# EasyEDA Pro project modular_design.eprj, board PCB1
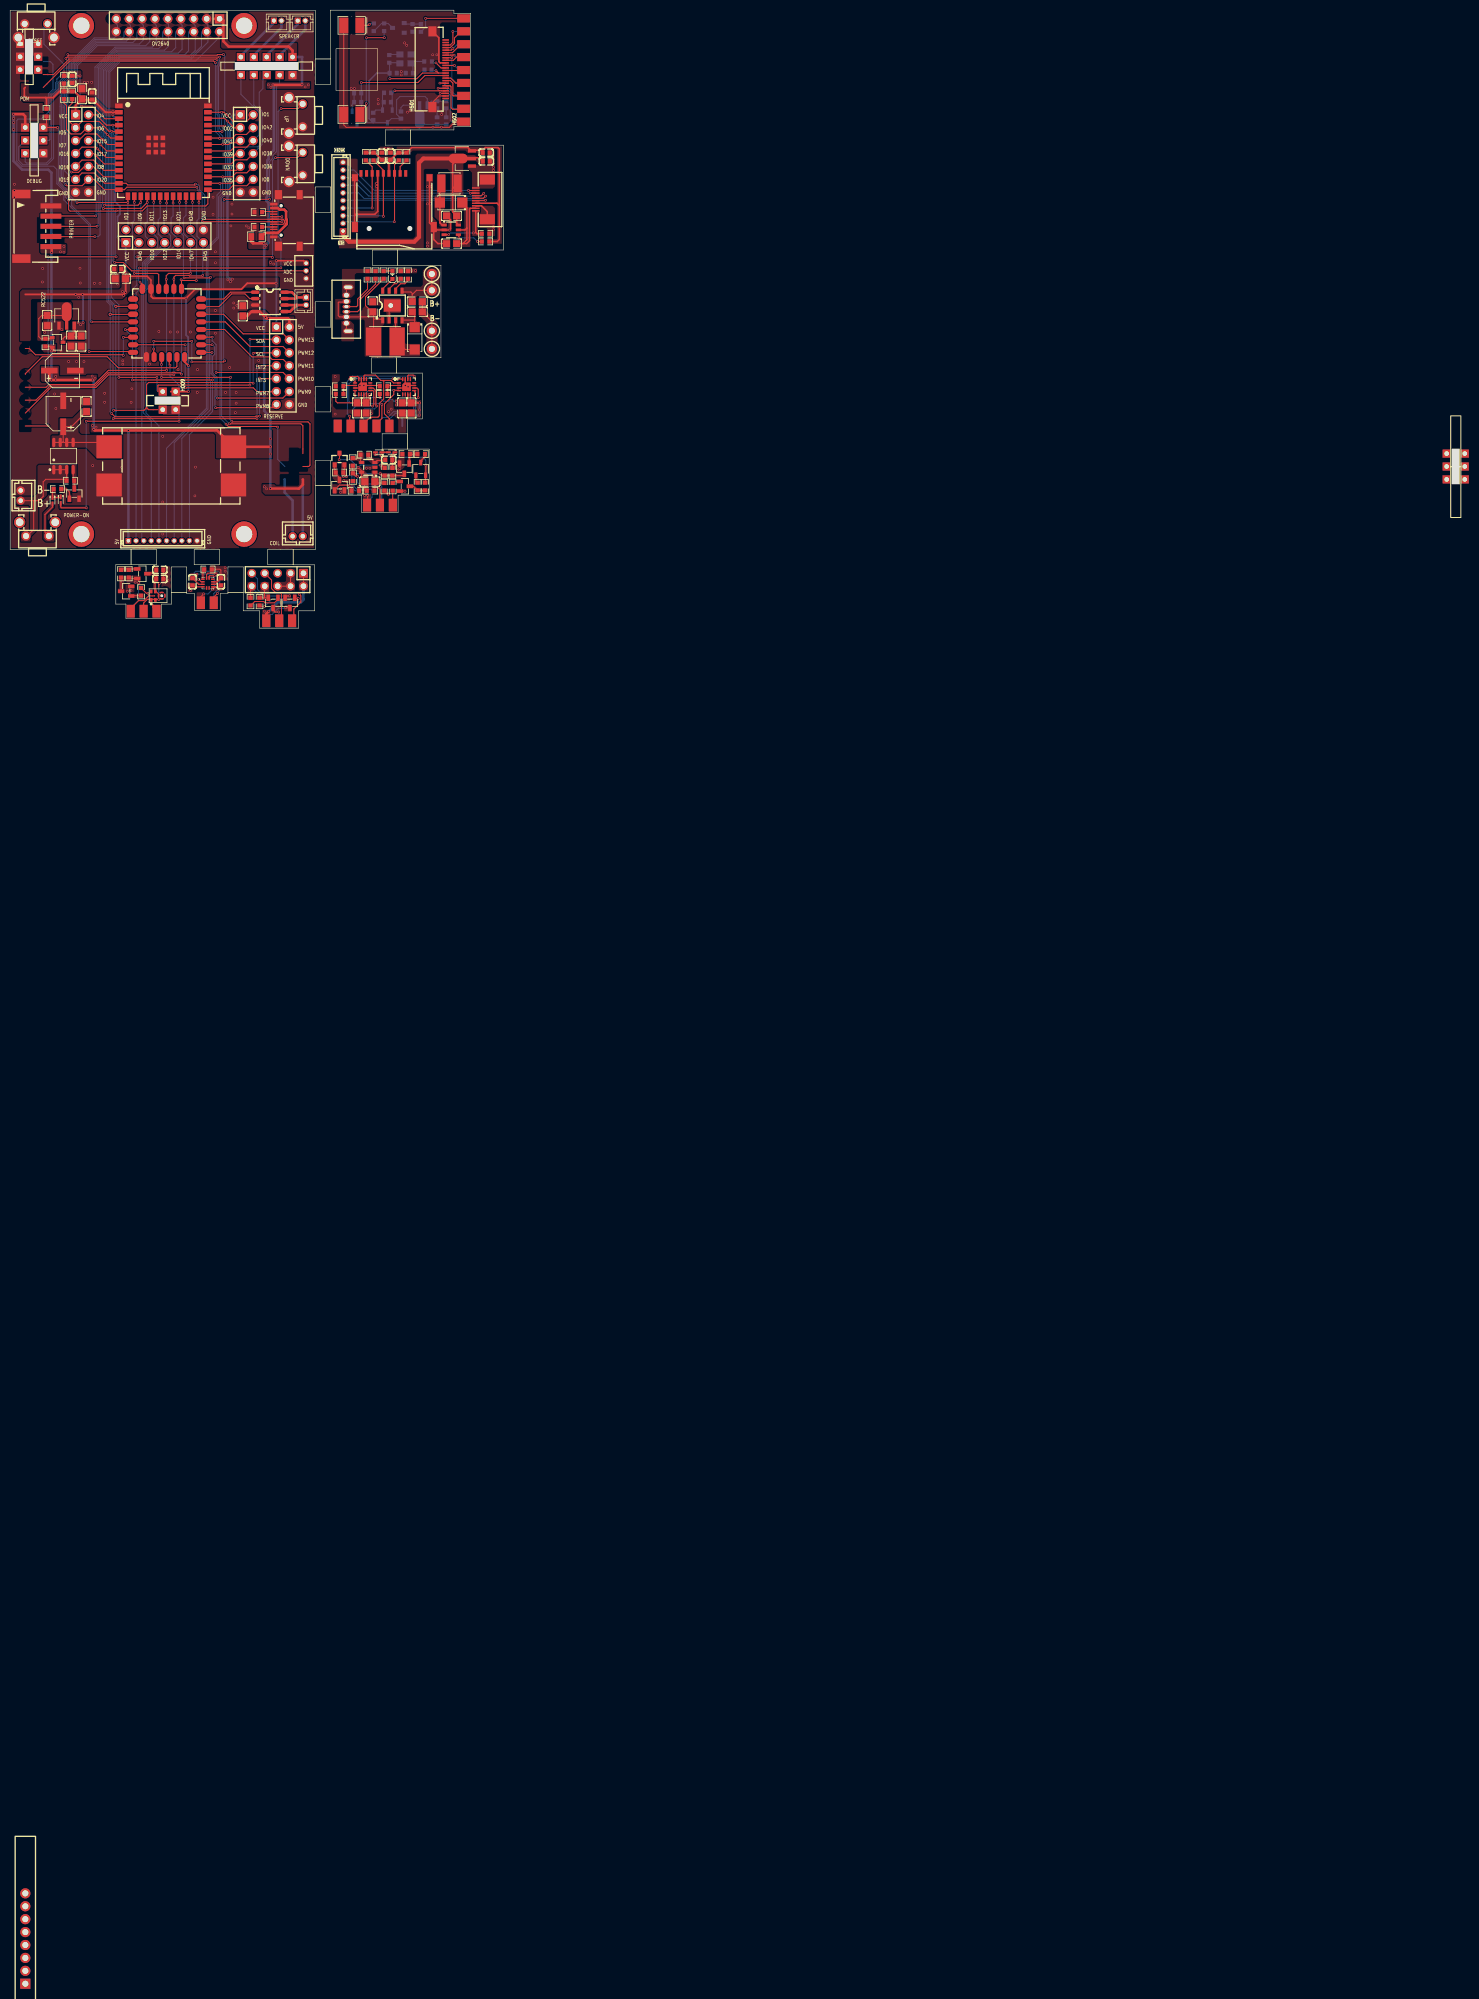
[diagram p7: board, top side]
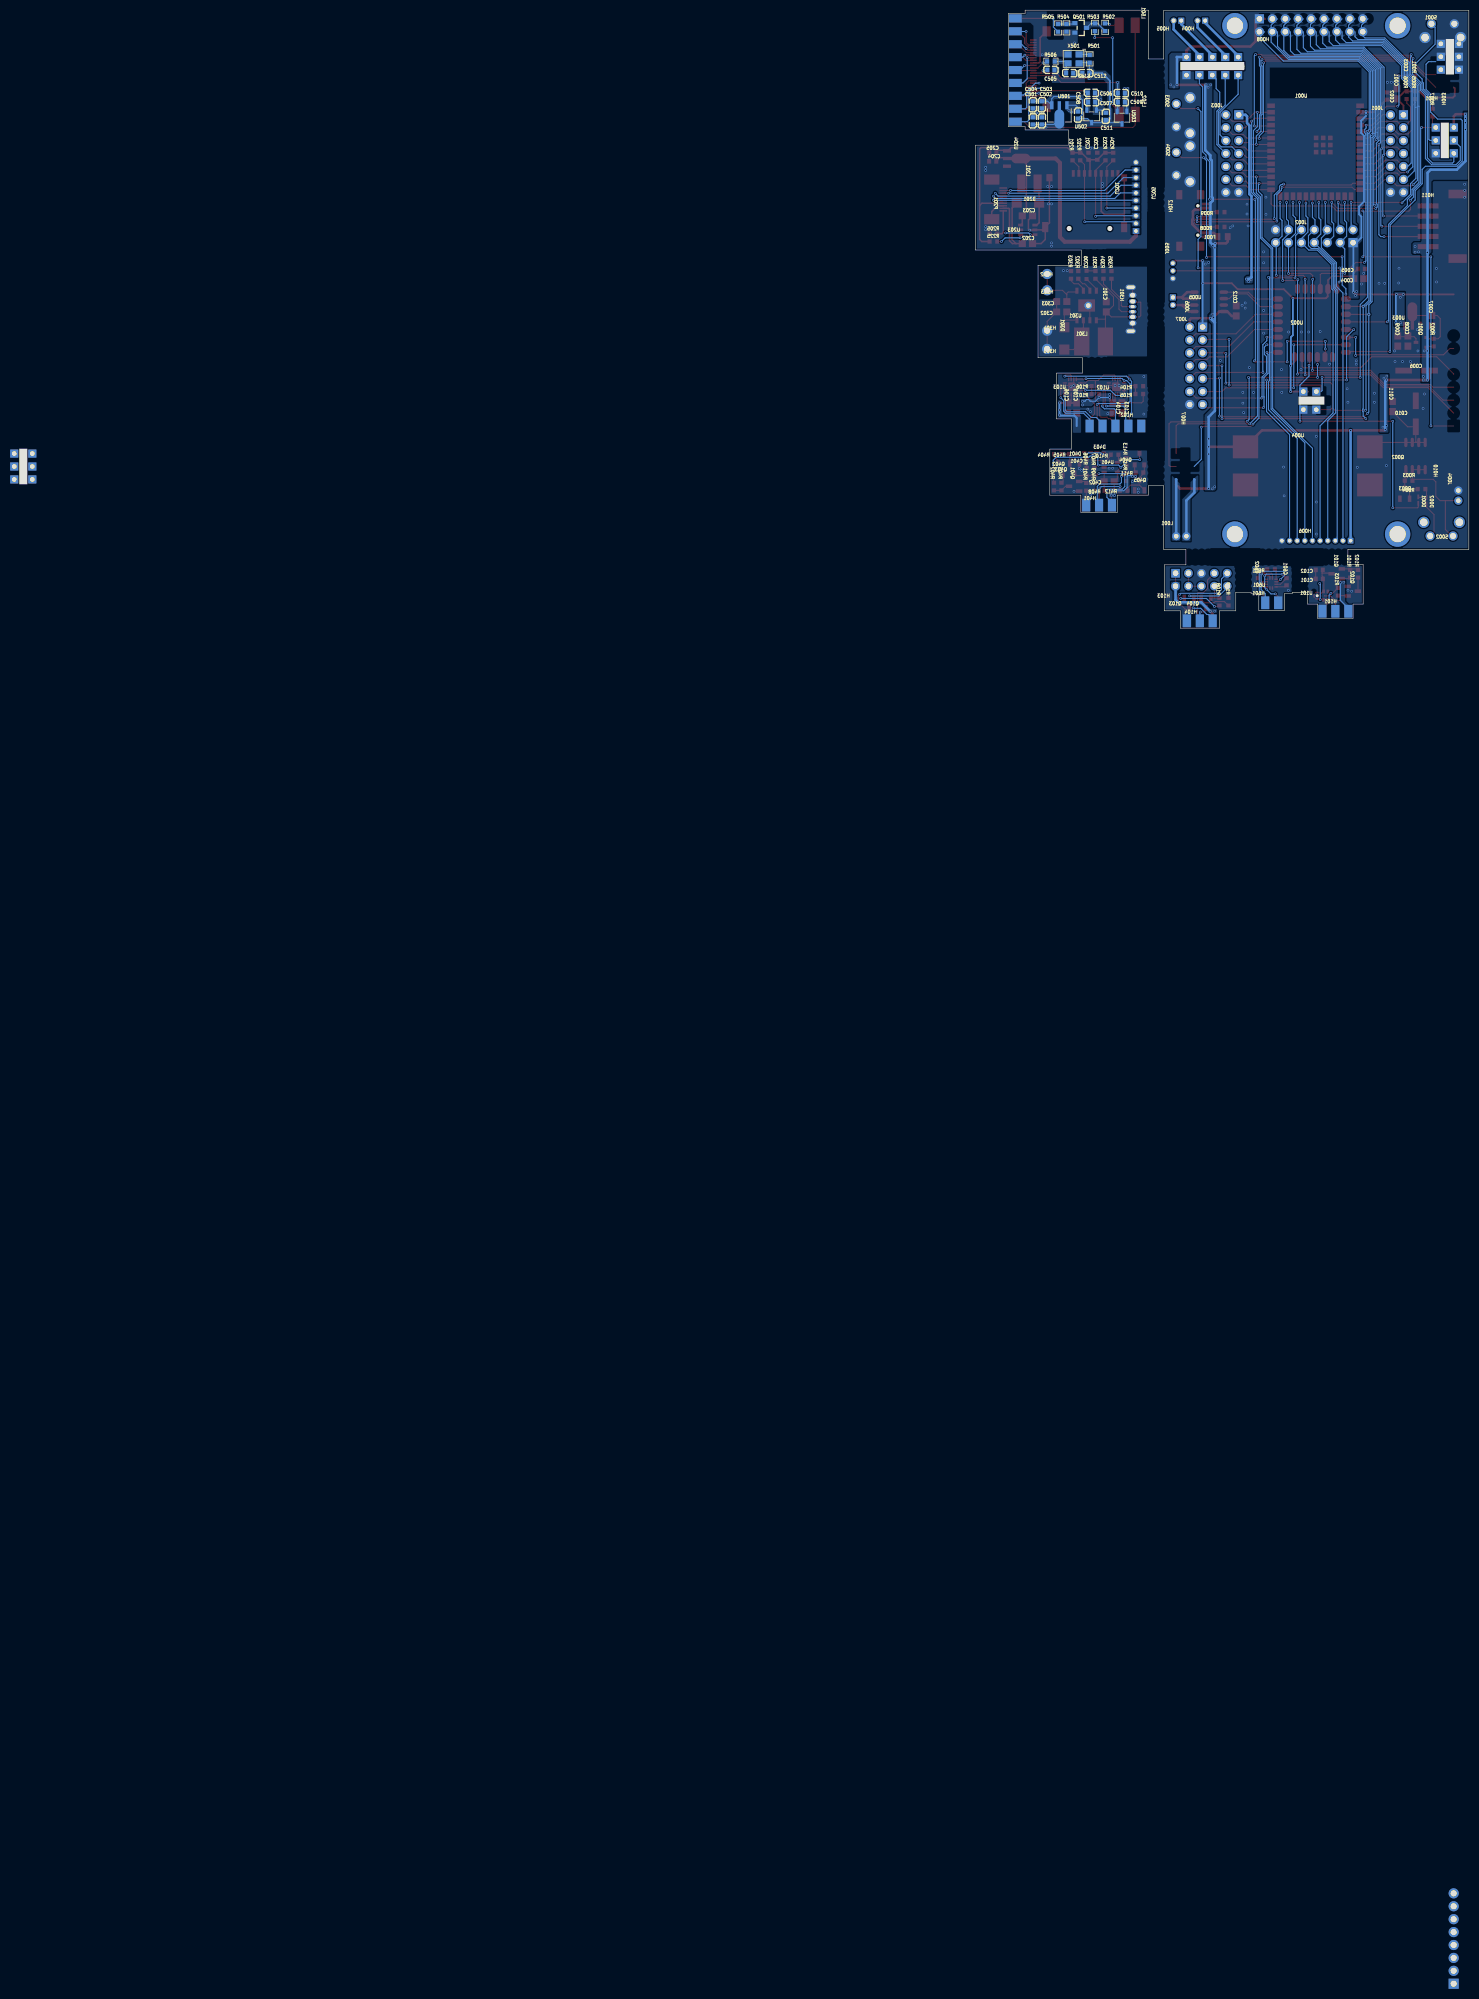
[diagram p8: board, bottom side, seen from below]

Outline 285.05 x 121.54 mm; copper layers: Top Layer, Bottom Layer. Coordinates in mm from the lower left corner of the outline.
Outline path: 0,121.49 60,121.49 60,111.94 62.99,111.94 62.99,121.52 63.01,121.54 87.25,121.54 87.25,120.91 90.56,120.91 90.56,98.63 87.25,98.63 87.25,97.99 78.76,97.99 78.76,94.99 96.99,94.99 96.99,74.37 76.22,74.37 76.22,71.37 84.71,71.37 84.71,53.18 76,53.18 76,50.16 81.05,50.16 81.05,41.15 78.12,41.15 78.12,35.22 82.39,35.22 82.39,26.15 76.29,26.15 76.29,22.75 69.14,22.75 69.14,26.16 63.03,26.16 63.03,28 60.02,28 60.02,15.47 55.64,15.47 55.64,12.45 59.89,12.45 59.89,3.42 59.87,3.4 56.73,3.4 56.73,0 49.04,0 49.04,3.4 45.83,3.4 45.83,7.04 42.83,7.04 42.83,6.84 41.3,6.84 41.3,3.5 36.23,3.5 36.23,6.84 34.71,6.84 34.71,7.04 31.7,7.04 31.7,4.73 29.73,4.73 29.73,1.93 22.76,1.93 22.76,4.73 20.78,4.73 20.78,12.49 23.78,12.49 23.78,15.49 0,15.49 0,121.49
Stack: Top Layer 0.035mm / Dielectric1 1.51mm FR4 er 4.5 / Bottom Layer 0.035mm

## Design rules (mm)
template: 自定义配置
spacing copperThickness1oz (default): track to track 0.102, other pairs 0.05 to 0.3
track width copperThickness1oz (default): min 0.127, default 0.254, max 2.54
track width copperThickness2oz: min 0.203, default 0.254, max 2.54
differential pair differentialPair (default): width min 0.127, default 0.254, max 2.54; gap min 0.152, default 0.152
via viaSize (default): diameter min 0.5, default 0.5, max 10; hole min 0.3, default 0.3, max 6.3

## Placement (name value [footprint] x y rotation side)
C001  10uF  [C0805]  14.12 105.1 90 top
C002  100nF  [C0603]  16.11 104.65 90 top
C003  100nF  [C0603]  12.22 107.93 90 top
C004  10uF  [C0805]  21.66 68.73 0 top
C005  100nF  [C0603]  21.15 70.64 0 top
C006  100uF  [CAP-SMD_BD6.3-L6.6-W6.6-LS7.2-R-RD]  10.26 50.64 180 top
C007  100nF  [C0805]  7.27 60.49 90 top
C008  10uF  [C0805]  11.99 56.46 90 top
C009  100nF  [C0805]  13.98 56.46 90 top
C010  100uF  [CAP-SMD_BD6.3-L6.6-W6.6-LS7.2-R-RD]  10.43 42.16 270 top
C011  100nF  [C0805]  15.02 43.58 270 top
C012  10uF  [C0805]  45.75 62.4 90 top
C101  100nF  [C0603]  29.42 9.68 180 top
C102  100nF  [C0603]  29.42 11.46 180 top
C103  100nF  [C0805]  68.22 43.31 90 top
C104  100nF  [C0805]  70 43.31 90 top
C105  100nF  [C0805]  77.11 43.31 90 top
C106  100nF  [C0805]  78.89 43.31 90 top
C201  100nF  [C0603]  74.79 92.81 270 top
C202  100nF  [C0805]  86.8 75.64 0 top
C203  100nF  [C0805]  86.8 81.09 0 top
C204  100nF  [C0603]  93.63 91.81 180 top
C205  100nF  [C0603]  93.61 93.52 180 top
C206  100nF  [C0603]  73.07 92.81 270 top
C301  10uF  [C0805]  71.29 63.19 90 top
C302  22uF  [C0805]  80.05 62.19 0 top
C303  100uF  [C0805]  80.05 64.23 0 top
C401  1uF  [C0603]  74.45 33.1 0 top
C402  1uF  [C0805]  70.73 28.82 180 top
C501  100nF  [C0603]  85.73 99.77 270 bottom
C502  10uF  [C0603]  83.95 99.77 270 bottom
C503  10uF  [C0603]  83.95 102.94 90 bottom
C504  100nF  [C0603]  85.73 102.94 90 bottom
C505  0.1UF  [C0603]  82.17 109.8 0 bottom
C506  10UF  [C0603]  74.21 105.29 180 bottom
C507  0.1UF  [C0603]  74.17 103.45 180 bottom
C508  0.1UF  [C0603]  76.84 100.91 270 bottom
C509  10UF  [C0603]  68.33 103.45 180 bottom
C510  0.1UF  [C0603]  68.33 105.23 180 bottom
C511  0.1UF  [C0603]  71.38 100.66 270 bottom
C512  100nF  [C0603]  75.32 109.17 0 bottom
C513  20pF  [C0603]  78.49 109.17 0 bottom
C601  104  [C0603]  35.85 9.12 270 top
C602  104  [C0603]  41.44 9.12 270 top
D001  1N4148WT  [SOD-523_L1.2-W0.8-LS1.6-RD]  9.93 25.19 270 top
D002  1N4148WT  [SOD-523_L1.2-W0.8-LS1.6-RD]  8.32 25.06 270 top
D201  SS14  [SMA_L4.3-W2.6-LS5.2-RD]  86.7 83.69 180 top
D206  LED_0603-R  [LED_0603]  75.16 69.52 90 top
D301  SS34A  [SMA_L4.3-W2.6-LS5.2-RD]  79.55 56.99 270 top
D401  1N4148WT  [SOD-523_L1.2-W0.8-LS1.6-RD]  75.01 34.58 180 top
D403  1N4148WT  [SOD-523_L1.2-W0.8-LS1.6-RD]  72.46 34.58 180 top
F001  10K  [R0805]  48.41 77 0 top
H001  PZ254V-12-6P  [PDM_MODULE]  4.73 108.88 180 top
H002  -  [I2S_HT517_STEREO]  50.45 110.53 90 top
H003  PZ254V-12-6P  [CH343_DEBUG]  4.73 95.92 0 top
H004  B2B-ZR(LF)(SN)  [CONN-TH_B2B-ZR-LF-SN]  52.6 119.48 180 top
H005  B2B-ZR(LF)(SN)  [CONN-TH_B2B-ZR-LF-SN]  57.3 119.48 180 top
H006  -  [connector_p10_1.5mm]  30 17.18 0 top
H007  -  [Metal_Detect]  55.78 31.79 180 top
H008  -  [connector_p2*9_2.54]  30 118.57 180 top
H009  A2541HWV-2x2P  [SC7A20_MODULE]  30 44.74 270 top
H010  -  [RFID_RC522]  4.98 29.76 90 top
H011  HX20007-5AWB  [CONN-SMD_5P-P2.00_HX20007-5AWB]  5.11 79.03 270 top
H012  TYPEC-304S-ACP16  [USB-C-SMD_TYPEC-304S-ACP16]  54.38 80.18 90 top
H101  PZ254V-12-6P  [Finger_2*3]  23.7 3.33 0 top
H102  -  [Finger_2*5]  66.95 39.76 0 top
H103  MTP125-1205S1  [HDR-TH_10P-P2.54-V-M-R2-C5-S2.54]  52.59 9.53 180 top
H104  PZ254V-12-6P  [Finger_2*3]  50.36 1.45 0 top
H301  -  [typec-31-e-11]  66.09 62.73 90 top
H302  -  [Single_Pin]  82.92 69.66 0 top
H303  -  [Single_Pin]  82.92 66.44 0 top
H304  -  [Single_Pin]  82.92 58.49 0 top
H305  -  [Single_Pin]  82.92 54.92 0 top
H401  PZ254V-12-6P  [Finger_2*3]  70.17 24.19 0 top
H501  AFC01-S24FCA-00  [FPC-SMD_P0.50-24P_FGS-XJ-H2.0]  84.33 109.93 90 top
H502  -  [Finger_2*9]  89.16 104.69 90 top
H601  A2541HWV-2x2P  [Finger_2*2]  37.5 4.98 0 top
J001  2.54-2*7P母  [HDR-TH_14P-P2.54-V-F-R2-C7-S2.54-1]  14.13 93.34 270 top
J002  2.54-2*7P母  [HDR-TH_14P-P2.54-V-F-R2-C7-S2.54-1]  30.39 77.08 0 top
J003  2.54-2*7P母  [HDR-TH_14P-P2.54-V-F-R2-C7-S2.54-1]  46.51 93.34 270 top
J004  B2B-ZR(LF)(SN)  [connector_p2_2.0mm]  2.06 26.07 270 top
J005  -  [conn-dip-1*3-1.5mm]  58.19 70.27 270 top
J006  B2B-ZR(LF)(SN)  [CONN-TH_B2B-ZR-LF-SN]  58.19 64.3 90 top
J007  2.54-2*7P母  [HDR-TH_14P-P2.54-V-F-R2-C7-S2.54-1]  53.62 51.6 270 top
L001  470uH  [connector_p2_2.0mm]  56.54 18.07 0 top
L201  22uH  [IND-SMD_L4.0-W4.0]  86.39 87.47 180 top
L301  4.7uH  [IND-SMD_L5.8-W5.2]  73.79 56.38 0 top
L501  暖白3528LED灯珠  [LED-SMD_L3.6-W2.9-R-RD]  67.19 118.56 180 top
L502  暖白3528LED灯珠  [LED-SMD_L3.6-W2.9-R-RD]  67.19 101.04 180 top
NOREF  -  [Pad_e163]  14 18.49 0 top
NOREF#2  -  [Pad_e160]  14 118.49 0 top
NOREF#3  -  [Pad_e2609]  74.83 63.45 90 top
NOREF#4  -  [Pad_e164]  46 18.49 90 top
NOREF#5  -  [Pad_e162]  46 118.49 180 top
P201  0.5-10P上接  [FPC_0.5_10P_mirror]  93.81 84.3 90 top
Q001  SS8550  [SOT-23-3_L2.9-W1.4-P1.90-LS2.6-BR]  9.34 56.21 180 top
Q002  AO4407C  [SOP-8_L4.9-W3.9-P1.27-LS6.0-BL]  10.48 33.84 0 top
Q003  SS8050  [SOT-23-3_L2.9-W1.3-P1.90-LS2.4-BR]  12.6 26.46 270 top
Q101  AO3407  [SOT-23-3_L2.9-W1.3-P1.90-LS2.4-BR]  25.99 10.7 180 top
Q102  SS8050  [SOT-23-3_L2.9-W1.3-P1.90-LS2.4-BR]  22.81 7.27 0 top
Q103  SS8050  [SOT-23-3_L2.9-W1.3-P1.90-LS2.4-BR]  55.01 4.95 90 top
Q104  SS8050  [SOT-23-3_L2.9-W1.3-P1.90-LS2.4-BR]  51.7 4.95 90 top
Q401  MMBT3904  [SOT-23-3_L2.9-W1.3-P1.90-LS2.4-BR]  77.61 27.9 180 top
Q402  MMBT3906-7-F  [SOT-23-3_L2.9-W1.6-P1.90-LS2.8-BR]  80.72 31.32 270 top
Q403  AO3402A  [SOT-23-3_L2.9-W1.3-P1.90-LS2.4-BR]  77.51 31.37 90 top
Q404  AO3401A  [SOT-23_L2.9-W1.3-P1.90-LS2.4-BR]  64.76 33.25 270 top
Q405  MMBT3904  [SOT-23-3_L2.9-W1.3-P1.90-LS2.4-BR]  64.76 28.1 270 top
Q501  AO3404A  [SOT-23_L2.9-W1.3-P1.90-LS2.4-BR]  76.33 118.06 0 bottom
R001  10K  [R0603]  10.57 107.86 270 top
R002  10K  [R0603]  6.94 56.16 90 top
R003  10K  [R0603]  11.84 29 180 top
R004  10K  [R0603]  9.3 27.34 180 top
R005  10K  [R0603]  10.57 104.81 90 top
R006  10K  [R0603]  12.22 104.81 90 top
R007  10K  [R0603]  7.14 101.39 90 top
R008  10K  [R0603]  48.8 78.91 0 top
R009  10K  [R0603]  48.8 81.83 0 top
R101  10K  [R0603]  23.32 10.7 270 top
R102  10R  [R0603]  21.8 10.7 90 top
R103  1K  [R0603]  25.73 7.14 90 top
R104  NC  [R0603]  64.79 47.58 180 top
R105  NC  [R0603]  64.79 46.05 180 top
R106  NC  [R0603]  73.42 47.58 180 top
R107  NC  [R0603]  73.42 46.05 180 top
R108  NC  [R0603]  49.04 5.21 270 top
R109  NC  [R0603]  47.26 5.21 270 top
R201  10K  [R0603]  77.93 92.76 270 top
R202  10K  [R0603]  76.41 92.76 90 top
R203  10K  [R0603]  71.45 92.76 90 top
R204  10K  [R0603]  69.93 92.76 90 top
R205  10K  [R0603]  93.48 77.57 180 top
R225  10K  [R0603]  93.48 76.04 180 top
R301  1K  [R0603]  73.43 69.47 270 top
R302  10K  [R0603]  76.8 69.47 270 top
R303  10K  [R0603]  78.22 69.47 270 top
R304  10K  [R0603]  71.85 69.47 270 top
R305  10K  [R0603]  70.27 69.47 270 top
R401  10K  [R0603]  75.22 27.8 90 top
R402  10K  [R0603]  81.59 27.85 90 top
R403  10K  [R0603]  80.11 27.85 90 top
R404  10K  [R0603]  80.83 34.22 0 top
R405  10K  [R0603]  77.87 34.22 0 top
R406  10K  [R0603]  73.64 30.76 90 top
R407  10K  [R0603]  75.17 30.76 270 top
R408  10K  [R0603]  70.88 27.03 0 top
R409  10K  [R0603]  73.58 27.8 270 top
R410  10K  [R0603]  69.66 34.12 0 top
R411  10K  [R0603]  64.76 30.6 180 top
R412  10K  [R0603]  67.87 27.03 180 top
R413  10K  [R0603]  67.36 32.69 90 top
R414  10K  [R0603]  67.41 29.68 90 top
R501  1K  [R0603]  74.55 111.96 270 bottom
R502  1K  [R0603]  71.51 118.18 90 bottom
R503  1K  [R0603]  73.54 118.18 270 bottom
R504  1K  [R0603]  79.13 118.06 90 bottom
R505  1K  [R0603]  80.78 118.06 270 bottom
R506  1K  [R0603]  82.17 111.45 180 bottom
R601  10K  [R0603]  38.9 11.53 180 top
S001  TC-1102N-C-A-B  [SW-TH_TC-1102N-C-A-B]  5.11 117.51 180 top
S002  TC-1102N-C-A-B  [SW-TH_TC-1102N-C-A-B]  5.36 19.47 0 top
S003  TC-1102N-C-A-B  [SW-TH_TC-1102N-C-A-B]  56.17 100.84 90 top
S004  TC-1102N-C-A-B  [SW-TH_TC-1102N-C-A-B]  56.17 91.32 90 top
U001  -  [ESP32-S3-WROOM-1U]  30.26 93.85 0 top
U002  -  [GPBA02B-C]  32.03 59.73 0 top
U003  ME6206A33PG  [SOT-89-3_L4.5-W2.5-P1.50-LS4.2-BR]  11.1 60.85 270 top
U004  -  [CX8823_MO]  18.19 39.41 0 top
U005  -  [sop-8_l5.0-w4.0-p1.27-ls6.2-bl]  51.08 64.17 270 top
U101  -  [SD18OB261-104]  28.4 6.38 0 top
U102  HT517  [QFN-16_L3.0-W3.0-P0.50-TL-EP1.7]  69.31 47.48 0 top
U103  HT517  [QFN-16_L3.0-W3.0-P0.50-TL-EP1.7]  77.94 47.48 0 top
U201  -  [TF-01A]  75.54 82.27 0 top
U203  MT9201  [SOT-23-6_L2.9-W1.6-P0.95-LS2.8-BR]  86.74 78.33 180 top
U204  ME6206A33PG  [SOT-89-3_L4.5-W2.5-P1.50-LS4.2-BR]  89.45 92.36 0 top
U205  -  [connector_p10_1.5mm]  65.46 84.86 90 top
U301  CS5095E  [ESOP-8_L4.9-W3.9-P1.27-LS6.0-BL-EP]  75.16 63.45 0 top
U401  LM321-TR  [SOT-23-5_L3.0-W1.7-P0.95-LS2.8-BR]  70.42 31.62 0 top
U501  ME6206A33PG  [SOT-89-3_L4.5-W2.5-P1.50-LS4.2-BR]  80.52 101.49 90 bottom
U502  XC6206-2.8V  [SOT-23-3_L2.9-W1.6-P1.90-LS2.8-BR]  74.17 100.66 90 bottom
U503  XC6206-1.2V  [SOT-23-3_L2.9-W1.6-P1.90-LS2.8-BR]  68.2 100.4 90 bottom
U601  -  [LGA-12_L2.0-W2.0-P0.50-TL]  38.9 8.87 0 top
X501  24MHz  [OSC-SMD_4P-L3.2-W2.5-BL]  77.73 111.96 0 bottom

## Footprints (pads in the part's own frame, mm; a bottom-side part is the same pattern mirrored in y, then rotated)
C0603
  rect 0.8x0.9 smd: 1(-0.7,0) 2(0.7,0)
C0805
  rect 1.41x1.35 smd: 1(-1,0) 2(1,0)
CAP-SMD_BD6.3-L6.6-W6.6-LS7.2-R-RD
  rect 3.26x1.15 smd: 1(2.555,0) 2(-2.555,0)
CH343_DEBUG
  rect 1.6x1.6 hole 0.914: 1(-1.778,2.54) 2(1.778,2.54) 3(-1.778,0) 4(1.778,0) 5(-1.778,-2.54) 6(1.778,-2.54)
conn-dip-1*3-1.5mm
  round 1.1 hole 0.701: 1(-1.498,0) 2(0,0) 3(1.498,0)
CONN-SMD_5P-P2.00_HX20007-5AWB
  rect 1.001x4.099 smd: 1(-4,2.901) 2(-1.999,2.901) 3(0,2.901) 4(1.999,2.901) 5(4,2.901)
  rect 1.7x3.599 smd: 6(6.35,-2.901) 7(-6.35,-2.901)
CONN-TH_B2B-ZR-LF-SN
  rect 1.2x1.2 hole 0.8: 1(0.75,0.001)
  round 1.2 hole 0.8: 2(-0.75,-0.001)
connector_p2*9_2.54
  rect 1.801x1.801 hole 1.1: 1(-11.176,-1.27)
  round 1.801 hole 1.1: 2(-11.176,1.27) 3(-8.636,-1.27) 4(-8.636,1.27) 5(-6.096,-1.27) 6(-6.096,1.27) 7(-3.556,-1.27) 8(-3.556,1.27) 9(-1.016,-1.27) 10(-1.016,1.27) 11(1.524,-1.27) 12(1.524,1.27) 13(4.064,-1.27) 14(4.064,1.27) 15(6.604,-1.27) 16(6.604,1.27) 17(9.144,-1.27) 18(9.144,1.27)
connector_p2_2.0mm
  round 1.6 hole 0.899: 1(1.001,0.004) 2(-1.001,0.004)
connector_p10_1.5mm
  rect 1.1x1.1 hole 0.701: 1(-6.749,0.001)
  round 1.1 hole 0.701: 2(-5.25,0.001) 3(-3.749,0.001) 4(-2.251,0.001) 5(-0.75,0.001) 6(0.75,0.001) 7(2.251,0.001) 8(3.749,0.001) 9(5.25,0.001) 10(6.752,0.001)
CX8823_MO
  rect 5x4.5 smd: 1(1.27,-3.75) 2(25.73,-3.75) 3(1.27,-11.25) 4(25.73,-11.25)
ESOP-8_L4.9-W3.9-P1.27-LS6.0-BL-EP
  rect 0.6x1.2 smd: 1(-1.905,-2.909) 2(-0.635,-2.909) 3(0.635,-2.909) 4(1.905,-2.909) 5(1.905,2.909) 6(0.635,2.909) 7(-0.635,2.909) 8(-1.905,2.909)
  rect 3.3x2.4 smd: 9(0,0)
ESP32-S3-WROOM-1U
  rect 1.5x0.9 smd: 1(-8.877,8.895) 2(-8.877,7.625) 3(-8.877,6.355) 4(-8.877,5.085) 5(-8.877,3.815) 6(-8.877,2.545) 7(-8.877,1.275) 8(-8.877,0.005) 9(-8.877,-1.265) 10(-8.877,-2.535) 11(-8.877,-3.805) 12(-8.877,-5.075) 13(-8.877,-6.345) 14(-8.877,-7.615) 27(8.623,-7.615) 28(8.623,-6.345) 29(8.623,-5.075) 30(8.623,-3.805) 31(8.623,-2.535) 32(8.623,-1.265) 33(8.623,0.005) 34(8.623,1.275) 35(8.623,2.545) 36(8.623,3.815) 37(8.623,5.085) 38(8.623,6.355) 39(8.623,7.625) 40(8.623,8.895)
  rect 0.9x1.5 smd: 15(-7.112,-8.895) 16(-5.842,-8.895) 17(-4.572,-8.895) 18(-3.302,-8.895) 19(-2.032,-8.895) 20(-0.762,-8.895) 21(0.508,-8.895) 22(1.778,-8.895) 23(3.048,-8.895) 24(4.318,-8.895) 25(5.588,-8.895) 26(6.858,-8.865)
  rect 0.9x0.9 smd: 41(-3.027,2.575) 41(-3.027,1.175) 41(-3.027,-0.225) 41(-1.627,2.575) 41(-1.627,1.175) 41(-1.627,-0.225) 41(-0.227,2.575) 41(-0.227,1.175) 41(-0.227,-0.225)
Finger_2*2
  rect 1.6x2.5 smd: 1(0,0.006) 3(2.54,0.006)
  rect 1.6x2.5 smd far side: 2(0,0) 4(2.54,0)
Finger_2*3
  rect 1.6x2.5 smd: 1(0,0) 3(2.54,0) 5(5.08,0)
  rect 1.6x2.5 smd far side: 2(0,-0.006) 4(2.54,-0.006) 6(5.08,-0.006)
Finger_2*5
  rect 1.6x2.5 smd: 1(-2.54,0.003) 3(0,0.003) 5(2.54,0.003) 7(5.08,0.003) 9(7.62,0.003)
  rect 1.6x2.5 smd far side: 2(-2.54,-0.003) 4(0,-0.003) 6(2.54,-0.003) 8(5.08,-0.003) 10(7.62,-0.003)
Finger_2*9
  rect 1.6x2.5 smd: 1(-5.08,0.006) 3(-2.54,0.006) 5(0,0.006) 7(2.54,0.006) 9(5.08,0.006) 11(7.62,0) 13(10.16,0) 15(12.7,0) 17(15.24,0)
  rect 1.6x2.5 smd far side: 2(-5.08,0) 4(-2.54,0) 6(0,0) 8(2.54,0) 10(5.08,0) 12(7.62,0) 14(10.16,-0.006) 16(12.7,-0.006) 18(15.24,-0.006)
FPC-SMD_P0.50-24P_FGS-XJ-H2.0
  rect 0.3x1.3 smd: 1(-5.748,-1.3) 2(-5.248,-1.3) 3(-4.748,-1.3) 4(-4.248,-1.3) 5(-3.748,-1.3) 6(-3.248,-1.3) 7(-2.748,-1.3) 8(-2.248,-1.3) 9(-1.748,-1.3) 10(-1.248,-1.3) 11(-0.748,-1.3) 12(-0.248,-1.3) 13(0.252,-1.3) 14(0.752,-1.3) 15(1.252,-1.3) 16(1.752,-1.3) 17(2.252,-1.3) 18(2.752,-1.3) 19(3.252,-1.3) 20(3.752,-1.3) 21(4.252,-1.3) 22(4.752,-1.3) 23(5.252,-1.3) 24(5.752,-1.3)
  rect 2x1.6 smd: 25(7.45,1.3) 26(-7.45,1.3)
FPC_0.5_10P_mirror
  rect 0.299x1.501 smd: 1(-2.235,2.25) 2(-1.738,2.25) 3(-1.237,2.25) 4(-0.737,2.25) 5(-0.236,2.25) 6(0.264,2.25) 7(0.764,2.25) 8(1.265,2.25) 9(1.763,2.25) 10(2.263,2.25)
  rect 1.999x2.999 smd: 11(-3.884,-0.011) 12(3.919,-0.005)
GPBA02B-C
  oval 1.1x2 smd: 2(-6.042,6.993) 35(-4.341,6.983)
  oval 2x1.1 smd: 3(-7.862,5.003) 4(-7.862,3.503) 5(-7.862,2.003) 25(5.519,2.003) 26(5.519,3.503) 27(5.519,5.003)
  oval 2x1 smd: 6(-7.862,0.503) 7(-7.862,-0.997) 8(-7.862,-2.497) 9(-7.862,-3.997) 10(-7.862,-5.497) 20(5.519,-5.497) 21(5.519,-3.997) 22(5.519,-2.497) 23(5.519,-0.997) 24(5.519,0.503)
  oval 1x2 smd: 11(-5.242,-6.417) 12(-3.741,-6.417) 13(-2.241,-6.417) 14(-0.742,-6.417) 15(0.758,-6.417) 17(2.259,-6.417) 30(1.659,7.006) 31(0.159,7.003) 32(-1.341,6.973) 33(-2.821,6.983)
HDR-TH_10P-P2.54-V-M-R2-C5-S2.54
  rect 1.7x1.7 hole 1.1: 1(-5.08,-1.27)
  round 1.7 hole 1.1: 2(-5.08,1.27) 3(-2.54,-1.27) 4(-2.54,1.27) 5(0,-1.27) 6(0,1.27) 7(2.54,-1.27) 8(2.54,1.27) 9(5.08,-1.27) 10(5.08,1.27)
HDR-TH_14P-P2.54-V-F-R2-C7-S2.54-1
  rect 1.801x1.801 hole 1.1: 1(-7.62,-1.27)
  round 1.801 hole 1.1: 2(-7.62,1.27) 3(-5.08,-1.27) 4(-5.08,1.27) 5(-2.54,-1.27) 6(-2.54,1.27) 7(0,-1.27) 8(0,1.27) 9(2.54,-1.27) 10(2.54,1.27) 11(5.08,-1.27) 12(5.08,1.27) 13(7.62,-1.27) 14(7.62,1.27)
I2S_HT517_STEREO
  rect 1.6x1.6 hole 0.914: 1(-1.758,5.08) 2(1.798,5.08) 3(-1.758,2.54) 4(1.798,2.54) 5(-1.758,0) 6(1.798,0) 7(-1.758,-2.54) 8(1.798,-2.54) 9(-1.758,-5.08) 10(1.798,-5.08)
IND-SMD_L4.0-W4.0
  rect 1.6x3.5 smd: 1(-1.6,0) 2(1.6,0)
IND-SMD_L5.8-W5.2
  rect 3x5.5 smd: 1(2.325,0) 2(-2.325,0)
LED-SMD_L3.6-W2.9-R-RD
  rect 1.785x3.024 smd: 1(1.593,0) 2(-1.593,0)
LED_0603
  rect 0.8x0.8 smd: 1(-0.851,-0.01) 2(0.75,-0.005)
LGA-12_L2.0-W2.0-P0.50-TL
  rect 0.7x0.28 smd: 1(-1.002,0.75) 2(-1.002,0.25) 3(-1.002,-0.25) 4(-1.002,-0.75) 7(0.949,-0.75) 8(0.949,-0.25) 9(0.949,0.25) 10(0.949,0.75)
  rect 0.28x0.7 smd: 5(-0.277,-0.975) 6(0.224,-0.975) 11(0.224,0.975) 12(-0.277,0.975)
Metal_Detect
  rect 1.6x1.6 hole 0.914: 1(-230.251,2.54) 2(-226.695,2.54) 3(-230.251,0) 4(-226.695,0) 5(-230.251,-2.54) 6(-226.695,-2.54)
OSC-SMD_4P-L3.2-W2.5-BL
  rect 1.4x1.2 smd: 1(-1.1,-0.875) 2(1.1,-0.875) 3(1.1,0.875) 4(-1.1,0.875)
Pad_e160
  round 5 hole 3.2: (0,0)
Pad_e162
  round 5 hole 3.2: (0,0)
Pad_e163
  round 5 hole 3.2: (0,0)
Pad_e164
  round 5 hole 3.2: (0,0)
Pad_e2609
  round 1.524 hole 0.914: 1(0,0)
PDM_MODULE
  rect 1.6x1.6 hole 0.914: 1(-0.778,-0.96) 2(2.778,-0.96) 3(-0.778,-3.5) 4(2.778,-3.5) 5(-0.778,-6.04) 6(2.778,-6.04)
QFN-16_L3.0-W3.0-P0.50-TL-EP1.7
  oval 0.851x0.28 smd: 1(-1.501,0.75) 2(-1.501,0.249) 3(-1.501,-0.249) 4(-1.501,-0.75) 9(1.501,-0.75) 10(1.501,-0.249) 11(1.501,0.249) 12(1.501,0.75)
  oval 0.28x0.851 smd: 5(-0.75,-1.501) 6(-0.249,-1.501) 7(0.249,-1.501) 8(0.75,-1.501) 13(0.75,1.501) 14(0.249,1.501) 15(-0.249,1.501) 16(-0.75,1.501)
  custom 1.702x1.702 smd: 17(0,0)
R0603
  rect 0.806x0.864 smd: 1(-0.753,0) 2(0.753,0)
R0805
  rect 1.133x1.377 smd: 1(-1,0) 2(1,0)
RFID_RC522
  rect 2x2 hole 1.2: 1(-296.393,2)
  round 2 hole 1.2: 2(-293.853,2) 3(-291.313,2) 4(-288.773,2) 5(-286.233,2) 6(-283.693,2) 7(-281.153,2) 8(-278.613,2)
SC7A20_MODULE
  rect 1.6x1.6 hole 0.914: 1(-1.778,2.54) 2(1.778,2.54) 3(-1.778,0) 4(1.778,0)
SD18OB261-104
  rect 0.52x0.73 smd: 1(-0.673,-0.835) 2(0.146,-0.835) 4(0.146,0.835) 5(-0.673,0.835)
Single_Pin
  round 2 hole 1.2: 1(0,0)
SMA_L4.3-W2.6-LS5.2-RD
  rect 2x2 smd: 1(-2.2,0) 2(2.2,0)
SOD-523_L1.2-W0.8-LS1.6-RD
  rect 0.93x0.36 smd: 1(-0.635,0) 2(0.635,0)
SOP-8_L4.9-W3.9-P1.27-LS6.0-BL
  oval 0.63x1.865 smd: 1(-1.905,-2.683) 2(-0.635,-2.683) 3(0.635,-2.683) 4(1.905,-2.683) 5(1.905,2.683) 6(0.635,2.683) 7(-0.635,2.683) 8(-1.905,2.683)
sop-8_l5.0-w4.0-p1.27-ls6.2-bl
  oval 0.701x1.7 smd: 1(-1.905,-2.901) 2(-0.635,-2.901) 3(0.635,-2.901) 4(1.905,-2.901) 5(1.905,2.901) 6(0.635,2.901) 7(-0.635,2.901) 8(-1.905,2.901)
SOT-23-3_L2.9-W1.3-P1.90-LS2.4-BR
  rect 1.25x0.7 smd: 1(1,-0.95) 2(1,0.95) 3(-1,0)
SOT-23-3_L2.9-W1.4-P1.90-LS2.6-BR
  rect 0.91x0.6 smd: 1(1.055,-0.955) 2(1.055,0.955) 3(-1.055,0)
SOT-23-3_L2.9-W1.6-P1.90-LS2.8-BR
  rect 1.07x0.6 smd: 1(1.235,-0.95) 2(1.235,0.95) 3(-1.235,0)
SOT-23-5_L3.0-W1.7-P0.95-LS2.8-BR
  rect 1x0.6 smd: 1(1.3,-0.95) 2(1.3,0) 3(1.3,0.95) 4(-1.3,0.95) 5(-1.3,-0.95)
SOT-23-6_L2.9-W1.6-P0.95-LS2.8-BR
  rect 1x0.55 smd: 1(1.4,-0.95) 2(1.4,0) 3(1.4,0.95) 4(-1.4,0.95) 5(-1.4,0) 6(-1.4,-0.95)
SOT-23_L2.9-W1.3-P1.90-LS2.4-BR
  rect 1x0.8 smd: 1(1.15,-0.95) 2(1.15,0.95) 3(-1.15,0)
SOT-89-3_L4.5-W2.5-P1.50-LS4.2-BR
  rect 1.575x0.672 smd: 1(1.356,-1.5) 3(1.356,1.5)
  custom 5.377x1.9 smd: 2(-1.356,0)
SW-TH_TC-1102N-C-A-B
  round 1.801 hole 1.199: 1(-2.251,-1.349) 2(2.251,-1.349)
  round 2.2 hole 1.501: 3(-3.5,1.351) 4(3.5,1.351)
TF-01A
  rect 0.6x1.3 smd: 1(2.24,7.165) 2(1.141,7.165) 3(0.041,7.165) 4(-1.059,7.165) 5(-2.159,7.165) 6(-3.259,7.165) 7(-4.359,7.165) 8(-5.458,7.165) 9(-6.559,7.165)
  rect 1.199x1.399 smd: 10(-7.76,6.314) 13(6.921,6.314)
  rect 1.199x1.999 smd: 11(-7.76,-3.389) 12(7.76,-3.389)
typec-31-e-11
  oval 1.001x1.501 hole 0.914x0.96: 1(-2.751,-0.029) 6(2.748,-0.029)
  oval 0.899x1.501 hole 0.8x0.96: 2(-1.522,-0.029) 5(1.519,-0.029)
  oval 0.711x1.501 hole 0.6x0.8: 3(-0.5,-0.029) 4(0.5,-0.029)
  oval 1.001x1.999 hole 0.6x1.6: 7(-4.321,-0.4) 8(4.321,-0.4)
USB-C-SMD_TYPEC-304S-ACP16
  rect 1.8x1.45 smd: 13(-5.07,1.633) 14(5.07,1.633)
  rect 1.8x1.2 smd: 15(-5.07,-2.547) 16(5.07,-2.547)
  rect 0.55x1.45 smd: A1B12(-3.225,2.547) A4B9(-2.45,2.547) B1A12(3.22,2.547) B4A9(2.45,2.547)
  rect 0.3x1.45 smd: A5(-1.26,2.533) A6(-0.25,2.547) A7(0.25,2.547) A8(1.25,2.547) B5(1.75,2.547) B6(0.75,2.547) B7(-0.75,2.547) B8(-1.75,2.547)

## Nets
As in the schematic, except:
MIC_GND: C101.1 C102.1 H101.6 Q102.2
USB-: C301.2 C302.2 C303.2 H301.1 H301.6 H301.7 H301.8 H304.1 H305.1 NOREF#3.1 R302.1 R303.1 R304.1 R305.1 U301.2 U301.9

Pads without a net: H001 4; H012 A8 B8; H101 4; H501 1 23 24; S002 3 4; U102 5 6 12 13; U103 5 6 12 13; U201 1 8 9; U601 5 6 10

## Via types
v1: diameter 0.5, hole 0.305, Top Layer to Bottom Layer, 390 vias
v2: diameter 0.61, hole 0.305, Top Layer to Bottom Layer, 2 vias

## Routing (per net, layer and track width the routed paths; a pad name or vN(x,y) marks a point on that pad's centre or on a via; arc(x,y) is an arc through that point)
+5V: length 296.1
  Top Layer w0.2: R002.1 8.13,55.4 Q001.2
  Top Layer w0.5: C006.1 7.71,49.22 v1(8.12,48.81) v1(8.96,48.81) v1(16.18,48.81) ; v1(16.43,39.06) 16.61,38.89 v1(23.24,38.89) 40.69,38.89 U004.2 v1(51.17,35.66) ; C012.1 46.62,61.4 47.49,62.27 U005.4 49.08,62.27 v1(50.21,61.14) 50.4,60.94 v1(50.81,60.94) 54.63,60.94 54.89,60.69 J007.2 ; v1(8.17,73.9) 8.17,74.87 8.01,75.03 ; F001.1 47.41,76.02 47.75,75.68 v1(49.89,75.68) ; v1(51.17,27.44) 56.78,27.44 57.56,28.22 57.56,29.25 ; v1(8.17,54.52) 8.28,54.63 Q001.2 ; H003.1 2.95,100.69 2.56,101.08 v1(0.67,101.08) ; v1(51.68,106.84) 57.34,106.84 v1(57.39,106.9) ; H002.10 55.53,113.6 54.74,114.39 42.95,114.39 41.93,115.41 41.93,119.54 41.63,119.84 40.16,119.84
  Bottom Layer w0.5: 8.12,73.85 8.12,89.56 7.51,90.17 2.36,90.17 0.67,91.85 v1(0.67,98.07) v1(0.67,99.42) v1(0.67,100.26) v1(0.67,101.08) ; 8.12,73.85 v1(8.17,73.9) ; 8.12,73.85 8.12,54.47 ; 49.94,60.08 v1(49.94,74.81) 49.94,75.48 ; 49.94,60.08 49.94,42.74 51.17,41.51 v1(51.17,37.23) v1(51.17,35.66) v1(51.17,34.23) v1(51.17,27.44) ; 49.94,60.08 v1(50.81,60.94) ; L001.1 57.54,29.23 57.56,29.25 ; v1(49.89,75.68) 49.94,75.63 49.94,75.48 ; 23.25,17.19 23.25,38.88 v1(23.24,38.89) ; 8.12,54.47 v1(8.12,48.81) ; 8.12,54.47 v1(8.17,54.52) ; 49.94,75.48 50.45,75.48 50.81,75.84 50.81,83.7 50.73,83.7 50.35,84.08 50.35,84.62 50.55,84.82 50.55,91.98 50.81,92.24 50.81,92.97 51.83,93.99 51.83,106.69 v1(51.68,106.84) ; v1(16.43,39.06) 16.43,48.55 v1(16.18,48.81) ; H002.10 57.41,112.33 57.39,112.3 v1(57.39,106.9)
  vias: v1(8.78,54.52) v1(8.96,49.5) v1(9.91,74) v1(10.57,75.07) v1(10.57,73.94) v1(16.13,49.57) v1(16.18,39.83) v1(16.69,49.16) v1(16.89,39.52) v1(49.99,27.79) v1(50.35,75.28) v1(50.35,61.76) v1(50.45,27.39) v1(50.76,106.84) v1(51.27,106.39) v1(58,106.44) v1(58.61,106.84)
+12V: length 20.2
  Top Layer w0.2: Q002.8 Q002.7 10.26,36.52 ; 10.26,36.52 Q002.6 Q002.5 18.59,36.52 U004.1 ; 10.26,36.52 10.43,36.7 10.43,39.6 12.04,39.6 C011.2
GND:
  vias: v1(0.83,87.31) v1(0.83,86.08) v1(0.83,84.75) v1(6.39,70.74) v1(6.34,68.08) v1(6.79,58.19) v1(8.73,46.05) v1(8.99,43.2) v1(10.01,54.52) v1(10.16,58.7) v1(11.49,52.43) v1(13.05,52.43) v1(13.73,70.79) v1(13.78,67.88) v1(14.51,52.43) v1(14.6,107.35) v1(14.6,54.52) v1(15.24,107.35) v1(16.02,107.35) v1(16.22,31.97) v1(16.55,67.83) v1(17.66,67.83) v1(18.58,46.21) v1(18.58,44.43) v1(20.66,69.8) v1(21.13,67.68) v1(21.94,31.62) v1(22.14,52.57) v1(22.14,51.92) v1(23.78,44.42) v1(23.93,47.07) v1(27.4,51.92) v1(29.23,58.34) v1(30,37.72) v1(30,24.8) v1(30,18.5) v1(31.48,58.24) v1(32.92,58.24) v1(33.01,50.85) v1(35.43,58.24) v1(36.32,26.01) v1(36.43,31.67) v1(36.78,46.36) v1(36.84,50.85) v1(39.89,84.76) v1(39.89,81.4) v1(40.35,74) v1(40.35,71.84) v1(40.35,62.48) v1(40.35,58.02) v1(42.34,46.36) v1(43.16,51.25) v1(43.41,79.1) v1(43.62,83.4) v1(43.62,81.45) v1(43.97,63.95) v1(43.97,62.95) v1(44.28,42.38) v1(44.44,46.36) v1(44.44,44.25) v1(44.59,63.49) v1(46.42,79.1) v1(46.93,78.74) v1(48.87,52.63)
VCC: length 218.4
  Top Layer w0.2: Q001.3 10.39,56.94 10.77,57.32 13.84,57.32 C009.2 ; U003.3 12.6,58.08 C008.2
  Top Layer w0.3: U002.35 27.69,68.46 26.93,69.22 23.14,69.22 C004.2 22.66,69.83 C005.2
  Top Layer w0.35: v1(35.05,51.61) 34.29,52.37 34.29,53.31 ; U002.35 27.76,66.65 27.76,65.23 28.1,64.89 v1(34.59,64.89) 34.61,64.89 36.38,66.66 45.45,66.66 46.63,67.83 v1(52.29,67.83) ; 31.59,46.52 v1(35.05,46.52) ; 6.95,104.35 7.14,104.16 R007.2 ; 6.95,104.35 8.48,104.35 9.7,105.57 R005.2 ; 6.95,104.35 3.12,104.35 2.78,104.69 2.78,106.17 2.95,106.34 ; R001.2 R005.2 ; R005.2 R006.2 12.65,105.57 C001.1 ; J001.1 12.86,102.84 C001.1 ; J005.1 57.69,72.27 v1(52.34,72.27) ; C004.2 22.71,68.69 v1(22.71,66.04) 22.3,65.64 v1(14.24,65.64) v1(12.88,65.64) 2.97,65.64 ; U001.2 18.74,101.47 16.28,103.93 14.29,103.93 C001.1
  Bottom Layer w0.35: v1(20.21,101.68) v1(20.21,101.01) 20.21,100.78 21.18,99.81 21.18,97.41 20.62,96.85 20.62,83.89 21.59,82.93 21.59,81.4 21.13,80.94 21.13,76.81 22.71,75.22 ; v1(14.34,60.08) 14.34,65.53 v1(14.24,65.64) ; 52.35,67.77 J007.1 ; 52.35,67.77 52.35,72.26 v1(52.34,72.27) ; 52.35,67.77 v1(52.29,67.83) ; v1(34.59,64.89) 34.59,57.63 35,57.22 35,51.66 v1(35.05,51.61) v1(35.05,46.52) ; J002.1 22.71,75.75 22.71,75.22 ; 22.71,75.22 v1(22.71,66.04)
  Bottom Layer w0.5: J003.1 43.9,100.96 43.61,100.67 43.61,99.34 43.15,98.87 43.15,85.37 42.73,84.95 42.73,68.99 42.77,68.99 43.07,68.69 43.38,68.69 43.42,68.65 v1(43.71,68.65)
  vias: v1(13.37,60.08) v1(13.48,65.08) v1(13.86,59.67) v1(22.09,66.2) v1(22.3,65.43) v1(42.8,68.49) v1(43.31,68.14) v1(51.17,71.91) v1(51.83,71.6)
BTN_DN: length 61
  Top Layer w0.2: U002.3 v1(24.17,65.7) ; S004.2 56.49,92.54 v1(52.18,92.54) ; v1(51.58,72.9) 51.44,73.04 v1(24.91,73.04)
  Bottom Layer w0.2: v1(52.18,92.54) 51.58,91.95 v1(51.58,72.9) ; v1(24.17,65.7) 24.17,66.75 24.9,67.48 24.9,70.62 24.89,70.62 24.89,71.04 24.9,71.04 24.9,73.03 v1(24.91,73.04)
BTN_UP: length 68.7
  Top Layer w0.2: v1(53.27,102.2) 56.62,102.2 S003.2 ; v1(25.53,68.06) 25.99,67.6 U002.2 ; v1(53.23,70.86) 53.2,70.83 v1(25.4,70.83)
  Bottom Layer w0.2: v1(25.4,70.83) 25.26,70.69 25.26,68.33 v1(25.53,68.06) ; v1(53.23,70.86) 53.23,76.48 52.68,77.04 52.68,101.6 v1(53.27,102.2)
CAM_1V2: length 22.9
  Top Layer w0.2: H501.10 81.55,108.68 80.17,107.3 v1(69.05,107.3)
  Bottom Layer w0.2: U503.2 69.05,101.74 v1(69.05,107.3)
CAM_2V8: length 14.4
  Top Layer w0.2: H501.4 84.76,105.68 84.76,105.69 84.34,105.69 84.34,105.68 v1(75.63,105.68)
  Bottom Layer w0.2: U502.2 75.12,105.08 C506.1 75.23,105.29 v1(75.63,105.68)
CAM_3V3: length 56.5
  Top Layer w0.2: 84.2,109.18 H501.11 ; 84.2,109.18 v1(83.74,109.65) ; 84.2,109.18 81.08,109.18 79.96,108.07 v1(74.66,108.07)
  Bottom Layer w0.2: X501.4 76.51,111.21 R501.2 74.62,111.15 C512.1 74.66,109.12 v1(74.66,108.07) ; C505.2 83.03,109.65 v1(83.74,109.65) ; U503.3 68.46,99.42 74.17,99.42 74.96,100.21 C508.2 75.98,101.07 75.98,103.88 76.65,104.55 81.59,104.55 82.02,104.12 U501.3 82.82,103.64 C503.2 C504.2
  Bottom Layer w0.3: C512.1 72.09,109.17 70.58,107.66 70.58,100.22 71.37,99.42
CAM_5V0: length 49.5
  Top Layer w0.2: H502.1 87.47,99.61 86.34,98.48 66.09,98.48 65.59,98.97 L502.1 L501.1
  Bottom Layer w0.2: U501.2 81.59,99.07 C502.2 C501.2
  vias: v1(83.14,98.54) v1(84.78,98.54)
CAM_D0: length 4.2
  Top Layer w0.2: H501.19 86.96,113.18 88.63,114.85 H502.13
CAM_D1: length 5.5
  Top Layer w0.2: H502.15 88.67,117.39 87.37,116.08 87.37,115.01 86.54,114.18 H501.21
CAM_D2: length 5.9
  Top Layer w0.2: v1(87.05,117.35) 87.05,115.21 86.53,114.68 H501.22
  Bottom Layer w0.2: v1(87.05,117.35) 89.13,117.35 H502.16
CAM_D3: length 4
  Top Layer w0.2: H501.20 86.75,113.68 v1(87.05,113.98)
  Bottom Layer w0.2: H502.14 87.97,114.85 87.1,113.98 v1(87.05,113.98)
CAM_D4: length 3.7
  Top Layer w0.2: H501.18 85.65,112.7 86.64,112.7 86.64,112.7 87.06,112.7 87.06,112.7 v1(87.31,112.7)
  Bottom Layer w0.2: H502.12 87.7,112.31 v1(87.31,112.7)
CAM_D5: length 3.8
  Top Layer w0.2: H501.16 87.15,111.68 87.77,112.31 H502.11
CAM_D6: length 3.9
  Top Layer w0.2: H501.14 85.65,110.67 v1(87.35,110.67)
  Bottom Layer w0.2: v1(87.35,110.67) 88.25,109.77 H502.10
CAM_D7: length 3.6
  Top Layer w0.2: H501.12 89.07,109.68 H502.9
CAM_GND: length 28
  Top Layer w0.2: H501.2 84.33,104.68 83.03,103.38 83.03,102.48
  Top Layer w0.3: H501.25 84.3,116.11 84.3,111.43 84.55,111.18 H501.15
  Bottom Layer w0.2: C508.1 76.84,102.39 77.3,102.85 U501.1 ; C506.2 73.22,105 U502.1 71.91,101.89 C511.1 ; C503.1 83.95,100.47 C502.1 ; C501.1 85.73,100.47 C504.1 ; C510.2 C509.2 67.25,103.07 U503.1
  vias: v1(67.06,106.13) v1(67.69,106.13) v1(72.36,103.97) v1(72.36,103.12) v1(76.9,109.44) v1(76.9,108.81) v1(77.57,115.1) v1(77.97,114.65) v1(78.13,101.49) v1(78.64,101.84) v1(83.09,112.76) v1(83.89,112.76) v1(84.86,101.65) v1(84.86,101.03)
CAM_HREF: length 3.9
  Top Layer w0.2: H502.7 87.59,107.23 86.63,108.18 H501.9
CAM_PCLK: length 8
  Top Layer w0.2: v1(86.85,112.2) 86.83,112.18 H501.17
  Bottom Layer w0.2: H502.8 87.69,107.23 86.85,108.07 v1(86.85,112.2)
CAM_PWDN: length 6.2
  Top Layer w0.2: H502.5 87.17,104.69 87.05,104.8 87.05,107.2 86.57,107.68 H501.8
CAM_RESET: length 7.9
  Top Layer w0.2: H502.3 89.05,102.05 87,102.05 86.69,102.35 86.69,106.49 86.5,106.68 H501.6
CAM_SIOC: length 9.7
  Top Layer w0.2: 85.63,106.18 85.62,106.19 v1(84.14,106.19)
  Bottom Layer w0.2: v1(84.14,106.19) 85.77,106.19 86.95,105.01 86.95,102.41 87.21,102.15 H502.4
CAM_SIOD: length 10.8
  Top Layer w0.2: v1(84.55,105.18) 85.63,105.18 H501.3
  Bottom Layer w0.2: H502.2 86.84,99.61 86.54,99.91 86.54,104.75 86.11,105.18 v1(84.55,105.18)
CAM_VSYNC: length 6.8
  Top Layer w0.2: v1(84.5,107.2) 85.61,107.2 H501.7
  Bottom Layer w0.2: v1(84.5,107.2) 85.22,107.2 87.56,104.85 88.99,104.85 H502.6
CAM_XCLK: length 3.2
  Top Layer w0.2: v1(83.74,111.18) 84.73,110.18 H501.13
  Bottom Layer w0.2: v1(83.74,111.18) 83.2,111.18 R506.1
CMA_LIGHT: length 10.5
  Top Layer w0.2: H502.17 v1(81.7,119.93)
  Bottom Layer w0.2: R505.2 81.7,118.22 v1(81.7,119.93)
DEBUG_3V3: length 5.1
  Top Layer w0.2: H103.3 H103.4 H103.6
DEBUG_5V0: length 15
  Top Layer w0.2: H103.1 H103.2
  Top Layer w0.5: H104.1 50.36,2.82 v1(50.86,3.32)
  Bottom Layer w0.5: H103.2 57.67,5.58 57.17,5.08 52.63,5.08 v1(50.86,3.32)
  vias: v1(49.97,3.34)
DEBUG_BOOT: length 6
  Top Layer w0.2: v1(54.2,4) 54.95,4 Q103.3
  Bottom Layer w0.2: v1(54.2,4) 54.1,3.9 52.72,3.9 51.5,2.68 51.19,2.68 50.36,1.85 H104.2
DEBUG_DTR: length 11.8
  Top Layer w0.2: R109.1 47.26,8 H103.10 ; v1(54.91,6.34) 54.45,6.34 Q103.2
  Bottom Layer w0.2: H103.10 47.51,8.25 47.51,7.97 49.15,6.32 54.89,6.32 v1(54.91,6.34)
DEBUG_RESEST: length 3.4
  Top Layer w0.2: v1(52.8,3.17) 52.07,3.17 51.7,3.54 Q104.3
  Bottom Layer w0.2: H104.4 52.9,3.07 v1(52.8,3.17)
DEBUG_RTS: length 4
  Top Layer w0.2: R108.1 49.05,5.95 50.01,5.95 ; 50.01,5.95 50.01,8.21 H103.8 ; 50.01,5.95 Q104.2
DEBUG_RXD: length 11.5
  Top Layer w0.2: H103.7 51.4,9.45 51.4,7.78 52.21,6.96 53.23,6.96 53.34,6.85 53.34,1.89 H104.3
DEBUG_TXD: length 18.3
  Top Layer w0.2: v1(56.85,6.66) 57.16,6.35 57.16,5.13 55.78,3.75 55.78,1.79 H104.5
  Bottom Layer w0.2: v1(56.85,6.66) 56.66,6.84 49.37,6.84 48.64,7.57 48.64,9.67 H103.9
ESP_BOOT: length 123.2
  Top Layer w0.2: 2.98,39.76 7.44,39.76 v1(7.46,39.78) ; R007.1 7.14,99.1 H003.2 v1(9.3,98.46) ; J003.12 46.53,87.01 43.77,87.01 43,86.23 U001.27 38.88,83.44 38.47,83.03 26.94,83.03 25.97,82.06 v1(20.84,82.06) 20.8,82.02 11.78,82.02 11.5,82.3 v1(11.5,84.15) ; v1(7.47,73.03) v1(20.85,73.03)
  Bottom Layer w0.2: v1(7.47,73.03) 7.46,73.02 v1(7.46,39.78) ; v1(9.3,98.46) 9.47,98.29 9.47,87.54 10.85,86.16 10.85,84.79 v1(11.5,84.15) ; v1(20.84,82.06) 20.64,81.86 20.64,73.24 v1(20.85,73.03)
ESP_IO1: length 91.5
  Top Layer w0.2: 42.05,101.47 U001.39 ; 42.05,101.47 42.06,101.47 ; 42.05,101.47 43.82,99.7 46.53,99.7 J003.2 ; v1(42.45,40.12) 42.9,39.66 52.48,39.66 v1(52.61,39.54)
  Bottom Layer w0.2: 54,31.79 52.61,33.19 v1(52.61,39.54) ; v1(41.59,101.46) 41.59,98.63 42.34,97.87 42.34,85.7 41.28,84.64 41.28,41.29 v1(42.45,40.12)
ESP_IO2: length 87.9
  Top Layer w0.2: J003.3 44.02,98.42 v1(42.7,99.73) 42.15,100.29 39.1,100.29 39.02,100.2 U001.38 ; v1(43.1,40.18) 57.17,40.18 57.56,39.79 57.56,34.33
  Bottom Layer w0.2: v1(43.1,40.18) 41.58,41.7 41.58,84.51 42.7,85.63 v1(42.7,99.73)
ESP_IO3: length 63.7
  Top Layer w0.2: v1(13.14,83.64) 13.23,83.73 23.14,83.73 v1(23.15,83.73) U001.15
  Bottom Layer w0.2: v1(23.15,83.73) 23.15,78.73 J002.2 ; v1(13.14,83.64) 11.46,85.33 11.46,87.42 10.41,88.46 10.41,102.38 10.43,102.4 10.43,106.59 12.33,108.49 12.33,111.03 16.77,115.47 22.85,115.47 23.65,116.27 23.65,118.57 22.38,119.84
ESP_IO4: length 72.5
  Top Layer w0.2: J005.2 23.89,70.27 22.24,71.92 v1(20.54,71.92) ; U001.4 v1(20.19,98.93) 18.94,98.93 16.91,100.96 J001.2
  Bottom Layer w0.2: v1(20.54,71.92) 20.24,72.22 20.24,97 20.26,97.03 20.26,97.24 20.48,97.45 20.48,98.08 20.19,98.37 v1(20.19,98.93)
ESP_IO5: length 146.9
  Top Layer w0.2: v1(21.36,49.32) v1(28.86,49.32) ; J007.3 52.23,56.81 v1(47.15,56.81) ; v1(47.15,47.8) 29.12,47.8 29.05,47.73 29.05,46.52 ; U001.5 20.05,97.66 v1(19.97,97.74) 19.42,97.74 17.51,99.65 14.09,99.65 J001.3 11.46,99.82 11.46,102.53 12.22,103.29 R006.1
  Bottom Layer w0.2: v1(28.86,49.32) 28.86,46.71 29.05,46.52 ; 40.16,117.3 40.92,116.54 40.92,115.99 36.48,111.55 21.74,111.55 19.59,109.39 19.59,98.12 v1(19.97,97.74) 19.97,97.37 19.96,97.36 19.96,97.15 19.94,97.13 19.94,65.04 21.36,63.61 v1(21.36,49.32) ; v1(47.15,47.8) v1(47.15,56.81)
ESP_IO6: length 154.4
  Top Layer w0.2: R005.1 10.57,103.29 11.08,102.78 11.08,98.08 11.97,97.19 13.87,97.19 15.1,98.42 J001.4 17.76,98.42 v1(19.13,97.04) 19.79,96.39 21.38,96.39 ; v1(47.78,54.01) 47.91,54.14 J007.5 ; v1(20.35,42.84) 26.32,42.84 26.83,43.35 ; v1(47.78,48.17) 47.65,48.3 27.21,48.3 26.83,47.92 26.83,43.35 ; 29.05,42.97 27.21,42.97 26.83,43.35
  Bottom Layer w0.2: v1(47.78,48.17) v1(47.78,54.01) ; v1(20.35,42.84) 20.22,42.97 20.22,63.45 19.33,64.34 19.33,96.84 v1(19.13,97.04) 18.95,97.23 18.95,109.61 21.49,112.15 35.34,112.15 37.62,114.43 37.62,117.3
ESP_IO7: length 47.8
  Top Layer w0.2: U001.7 19.12,95.12 17.05,97.19 14.76,97.19 13.44,95.88 12.86,95.88
  Bottom Layer w0.2: v1(18.2,96.09) 18.05,96.24 18.05,96.57 18.03,96.59 18.03,97.5 18.05,97.52 18.05,109.98 21.12,113.06 33.01,113.06 33.81,113.86 33.81,118.57 32.54,119.84
ESP_IO8: length 53
  Top Layer w0.2: U001.12 18.39,88.77 16.36,90.8 J001.10 14.59,90.8 13.44,89.65 12.1,89.65 v1(12.04,89.7)
  Bottom Layer w0.2: 24.92,119.84 26.19,118.57 26.19,115.67 25.39,114.87 17.02,114.87 12.93,110.78 12.93,108.24 11.03,106.34 11.03,90.72 v1(12.04,89.7)
ESP_IO9: length 63.1
  Top Layer w0.2: v1(18.53,83.17) 25.13,83.17 v1(25.69,83.73) U001.17
  Bottom Layer w0.2: 35.08,117.3 35.08,113.55 34.28,112.75 21.24,112.75 18.35,109.86 18.35,97.4 18.33,97.38 18.33,96.71 18.7,96.34 18.7,83.34 v1(18.53,83.17) ; v1(25.69,83.73) 25.69,78.73 J002.4
ESP_IO10: length 66.6
  Top Layer w0.2: U001.18 v1(26.96,83.73) 25.78,82.56 18.36,82.56 v1(18.32,82.52)
  Bottom Layer w0.2: J002.5 26.57,77.09 26.57,79.54 26.96,79.93 v1(26.96,83.73) ; v1(18.32,82.52) 18.03,82.81 18.03,83.38 18.19,83.54 18.19,95.39 17.69,95.88 17.69,95.91 17.68,95.92 17.68,110.04 20.99,113.36 31.74,113.36 32.54,114.16 32.54,117.3
ESP_IO11: length 70.2
  Top Layer w0.2: U001.19 v1(28.23,83.73)
  Bottom Layer w0.2: H006.2 24.75,65.91 26.03,67.19 26.03,71.88 29,74.84 29,76.73 27.85,77.89 J002.6 28.23,78.73 v1(28.23,83.73)
ESP_IO12: length 70.5
  Top Layer w0.2: U001.20 v1(29.5,83.73)
  Bottom Layer w0.2: H006.3 25.89,17.55 25.89,66.5 26.34,66.95 26.34,71.75 30.39,75.8 J002.7 30.39,76.24 29.11,77.51 29.11,80.3 29.5,80.69 v1(29.5,83.73)
ESP_IO13: length 72.1
  Top Layer w0.2: v1(30.77,83.61) U001.21
  Bottom Layer w0.2: v1(30.77,83.61) 30.77,80.82 30.25,80.3 30.25,78.48 J002.8 31.54,77.2 31.54,75.23 30.97,74.66 29.67,74.66 26.64,71.63 26.64,66.83 26.19,66.38 26.19,42.33 27.75,40.77 H006.4
ESP_IO14: length 73.1
  Top Layer w0.2: U001.22 v1(32.04,83.61)
  Bottom Layer w0.2: v1(32.04,83.61) 32.04,81.07 31.65,80.68 31.65,77.89 32.93,76.62 J002.9 31.47,74.36 29.8,74.36 26.94,71.5 26.94,66.7 26.7,66.46 26.7,42.33 29.25,39.78 H006.5
ESP_IO15: length 71
  Top Layer w0.2: U001.8 18.99,93.85 v1(17.68,95.16) 16.97,95.88 15.4,95.88 ; v1(16.66,77) 8.04,77 8.01,77.03
  Bottom Layer w0.2: v1(16.66,77) 17.3,77 17.68,77.38 v1(17.68,95.16) 17.38,95.46 17.38,110.17 20.87,113.66 30.34,113.66 31.14,114.46 31.14,116.82 31.15,116.83 31.15,118.69 30,119.84
ESP_IO16: length 67.7
  Top Layer w0.2: v1(17.1,79.05) 17.08,79.03 8.01,79.03 ; J001.7 14.13,94.6 16.84,94.6 v1(17.18,94.27) 18.87,92.58 U001.9
  Bottom Layer w0.2: 30,117.3 30,114.76 29.2,113.96 20.74,113.96 17.08,110.29 17.08,94.37 v1(17.18,94.27) 17.3,94.15 17.3,79.25 v1(17.1,79.05)
ESP_IO17: length 64.4
  Top Layer w0.2: v1(16.8,81.07) 8.04,81.07 8.01,81.03 ; J001.8 16.46,93.34 v1(16.8,93) 18.49,91.31 U001.10
  Bottom Layer w0.2: v1(16.8,81.07) 16.91,81.18 16.91,92.89 v1(16.8,93) 16.68,93.12 16.68,110.32 20.62,114.26 27.93,114.26 28.73,115.06 28.73,118.57 27.46,119.84
ESP_IO18: length 49.8
  Top Layer w0.2: U001.11 18.4,90.04 16.38,92.05 14.12,92.05 J001.9
  Bottom Layer w0.2: J001.9 12.01,90.8 11.33,91.48 11.33,106.21 13.24,108.12 13.24,110.66 17.15,114.57 26.66,114.57 27.46,115.37 27.46,117.3
ESP_IO19: length 92
  Top Layer w0.2: v1(38.26,80.56) 38.39,80.43 H012.A7 52.65,80.43 52.66,80.43 53.64,80.43 53.93,80.14 53.93,79.72 53.64,79.43 H012.B7 ; v1(36.42,87.34) 36.24,87.16 23.14,87.16 22.8,87.5 U001.13 18.54,87.5 16.54,89.5 14.11,89.5 J001.11
  Bottom Layer w0.2: v1(38.26,80.56) 38.26,85.18 37.24,86.19 37.24,86.91 36.92,87.22 36.35,87.22 36.48,87.35 36.48,87.42 ; 24.92,117.3 24.92,115.97 24.12,115.17 16.9,115.17 12.63,110.91 12.63,108.37 10.73,106.46 10.73,89.92 12.39,88.26 J001.11
ESP_IO20: length 91.4
  Top Layer w0.2: H012.B6 53.43,80.93 v1(53.43,80.93) ; v1(10.94,87.21) 11.15,87.01 14.15,87.01 J001.12 16.51,88.26 18.53,86.23 U001.14 22.47,86.23 22.97,86.73 36.7,86.73 v1(36.72,86.72) ; v1(37.75,80.05) 37.87,79.93 H012.A6 53.43,79.93 v1(53.43,79.93)
  Bottom Layer w0.2: v1(36.72,86.72) 36.86,86.58 36.86,86.15 37.75,85.26 v1(37.75,80.05) ; v1(10.94,87.21) 10.11,88.04 10.11,102.51 10.12,102.52 10.12,106.71 12.03,108.62 12.03,111.16 16.65,115.77 21.83,115.77 22.38,116.33 22.38,117.3 ; v1(53.43,79.93) v1(53.43,80.93)
ESP_IO21: length 76.6
  Top Layer w0.2: v1(34.19,68.88) 39.28,68.88 v1(39.4,69) ; U001.23 v1(33.31,83.73)
  Bottom Layer w0.2: v1(34.19,68.88) 34.06,69.01 34.06,75.32 34.08,75.34 34.08,76.29 34.06,76.3 34.06,77.21 J002.10 33.31,78.73 v1(33.31,83.73) ; v1(39.4,69) 39.35,69.05 39.35,69.1 39.18,68.93 39.18,48.7 39.4,48.48 39.4,42.97 33.75,37.32 H006.8
ESP_IO35: length 81.4
  Top Layer w0.2: J003.11 44.91,87.92 43.87,87.92 43.45,87.5 U001.28
  Bottom Layer w0.2: H006.6 30.75,35.38 38.58,43.21 38.58,74.75 40.67,76.85 40.67,85.18 41.37,85.88 41.37,87.3 v1(41.23,87.44)
ESP_IO36: length 85.3
  Top Layer w0.2: J003.10 46.54,89.56 44.43,89.56 43.65,88.77 U001.29
  Bottom Layer w0.2: H006.7 32.25,36.45 38.88,43.08 38.88,74.63 40.97,76.72 40.97,84.82 41.79,85.64 v1(41.79,88.76)
ESP_IO37: length 6.7
  Top Layer w0.2: U001.30 44.49,90.04 J003.9
ESP_IO38: length 26.7
  Top Layer w0.2: J003.8 46.55,92.11 44.28,92.11 43.49,91.31 U001.31
  Bottom Layer w0.2: H002.5 49.69,108.01 49.69,106.11 48.98,105.4 48.98,102.25 49.54,101.69 49.54,95.09 J003.8
ESP_IO39: length 25.6
  Top Layer w0.2: J003.7 44.44,93.34 43.69,92.58 U001.32
  Bottom Layer w0.2: J003.7 46.56,94.65 48.67,94.65 49.24,95.22 49.24,101.56 47.91,102.89 H002.3
ESP_IO40: length 24.6
  Top Layer w0.2: U001.33 43.32,93.85 44.08,94.6 46.51,94.6 47.78,95.88
  Bottom Layer w0.2: H002.1 45.37,105.01 48.94,101.44 48.94,97.03 47.78,95.88
ESP_IO41: length 59.4
  Top Layer w0.2: 45.24,95.88 44.84,95.47 43.31,95.47 42.96,95.12 U001.34 ; v1(40.68,111.81) 40.55,111.93 11.58,111.93 8.54,108.88 6.51,108.88
  Bottom Layer w0.2: v1(41.79,95.16) 41.79,96.79 40.88,97.7 40.88,100.81 40.67,101.02 40.67,110.54 40.88,110.75 40.88,111.61 v1(40.68,111.81)
ESP_IO42: length 61.1
  Top Layer w0.2: v1(40.37,111.19) 40.01,111.55 11.71,111.55 6.51,106.34 ; U001.35 43.67,96.39 44.38,97.1 46.47,97.1 J003.4
  Bottom Layer w0.2: v1(41.21,96.3) 41.21,96.81 40.37,97.65 v1(40.37,111.19)
ESP_IO45: length 75.7
  Top Layer w0.2: v1(32.19,49.82) 19.33,49.82 16.82,47.31 8,47.31 2.98,42.3 ; U001.26 v1(37.12,83.73) ; U002.31 v1(32.19,68.62) 32.19,69.03 32.54,69.38 35.14,69.38 35.25,69.27 37.76,69.27 v1(37.87,69.38)
  Bottom Layer w0.2: v1(37.12,83.73) 37.12,80.56 36.73,80.18 36.73,77.09 J002.13 37.87,75.68 v1(37.87,69.38) ; v1(32.19,68.62) v1(32.19,49.82)
ESP_IO46: length 24
  Top Layer w0.2: v1(24.4,69.77) 28.98,69.77 29.21,69.54 U002.33 ; U001.16 24.42,83.74 v1(24.41,83.73)
  Bottom Layer w0.2: v1(24.41,83.73) 24.41,80.18 24.03,79.8 24.03,77.09 J002.3 25.31,75.48 24.4,74.57 v1(24.4,69.77)
ESP_IO47: length 70.7
  Top Layer w0.2: v1(30.76,50.71) 19.33,50.71 16.54,47.92 7.59,47.92 7.05,47.38 2.98,47.38 ; U001.24 v1(34.58,83.73) ; U002.32 v1(30.69,68.62) 30.69,69.31 31.15,69.77 v1(35.46,69.77)
  Bottom Layer w0.2: v1(35.46,69.77) 35.46,75.81 J002.11 35.47,76.24 34.06,77.64 34.06,77.86 34.08,77.88 34.08,78.83 34.06,78.84 34.06,80.68 34.58,81.2 v1(34.58,83.73) ; v1(30.69,68.62) 30.76,68.55 v1(30.76,50.71)
ESP_IO48: length 73.7
  Top Layer w0.2: v1(33.68,49.95) 33.43,50.2 32.51,50.2 32.4,50.32 31.98,50.32 31.87,50.2 19.25,50.2 16.66,47.62 7.85,47.62 5.07,44.84 2.98,44.84 ; U001.25 v1(35.85,83.73) ; v1(36.6,68.38) 33.77,68.38 33.69,68.46 ; U002.30 33.69,68.46 ; 33.69,68.46 v1(33.61,68.54)
  Bottom Layer w0.2: v1(33.68,49.95) 33.68,68.47 v1(33.61,68.54) ; v1(36.6,68.38) 36.62,68.39 36.62,76.29 36.6,76.3 36.6,76.37 35.47,77.51 J002.12 35.46,78.36 35.46,80.05 35.85,80.43 v1(35.85,83.73)
ESP_RESET: length 45.6
  Top Layer w0.2: U001.3 18.61,100.2 16.16,102.66 v1(14,102.66) ; v1(10.57,109.39) R001.1 12.2,108.62 12.21,108.62 v1(13.74,108.62)
  Bottom Layer w0.2: v1(13.74,108.62) 13.74,102.91 v1(14,102.66) ; S001.1 6.63,118.14 6.63,114.85 10.57,110.91 v1(10.57,109.39) 9.17,107.99 9.17,107.47 8.91,107.21 8.91,106.04 7.85,104.97 7.85,96.13 7.65,95.92 H003.4
ESP_RXD: length 76.3
  Top Layer w0.2: U001.36 38.9,97.68 v1(41.67,97.68) ; v1(10.95,112.05) 11.2,112.31 v1(41.18,112.31)
  Bottom Layer w0.2: H003.5 2.95,91.73 3.2,91.48 7.14,91.48 8.16,92.5 8.16,104.85 9.22,105.91 9.22,107.09 11.08,108.95 11.08,111.93 v1(10.95,112.05) ; v1(41.18,112.31) 41.18,110.63 40.97,110.42 40.97,101.15 41.18,100.94 41.18,98.23 41.67,97.74 v1(41.67,97.68)
ESP_TXD: length 82.1
  Top Layer w0.2: v1(41.94,112.82) 40.8,112.82 40.67,112.69 11.46,112.69 v1(11.33,112.82) ; U001.37 39.05,98.76 v1(42.19,98.76)
  Bottom Layer w0.2: v1(41.94,112.82) 42.19,112.56 v1(42.19,98.76) ; v1(11.33,112.82) 11.33,112.43 11.46,112.31 11.46,111.44 11.42,111.41 11.42,108.87 9.52,106.96 9.52,105.79 8.54,104.8 8.54,92.37 7.31,91.15 2.52,91.15 1.68,91.99 1.68,94.65 H003.3
HT517_BLCK: length 27.3
  Top Layer w0.2: v1(66.76,48.98) 66.8,49.02 66.8,49.39 66.91,49.5 68.34,49.5 68.56,49.29 U102.16 ; v1(66.76,41.7) 66.76,39.94 66.95,39.76 ; U103.14 78.19,49.66 78.3,49.77 79.24,49.77 v1(79.46,49.55)
  Bottom Layer w0.2: v1(79.46,49.55) 67.34,49.55 v1(66.76,48.98) 66.3,48.52 66.3,42.15 v1(66.76,41.7)
HT517_CN1_N: length 10.6
  Top Layer w0.2: v1(72.09,43.7) 71.91,43.87 71.91,46.7 71.38,47.23 U102.10
  Bottom Layer w0.2: 69.49,39.75 69.49,42.9 69.72,43.13 71.66,43.13 72.09,43.56 v1(72.09,43.7)
HT517_CN1_P: length 11.6
  Top Layer w0.2: U102.9 71.32,46.73 71.5,46.54 71.5,43.92 v1(71.26,43.68)
  Bottom Layer w0.2: v1(71.26,43.68) 67.97,43.68 67.47,43.17 67.47,39.95 67.27,39.75 66.95,39.75
HT517_CN2_N: length 12.5
  Top Layer w0.2: v1(80.24,45.32) 80.24,46.99 80,47.23 79.44,47.23
  Bottom Layer w0.2: v1(80.24,45.32) 79.66,44.75 79.66,42.67 79.25,42.26 75.74,42.26 74.57,41.09 74.57,39.75
HT517_CN2_P: length 13
  Top Layer w0.2: 79.44,46.73 79.57,46.6 79.57,46.46 79.64,46.39 79.64,45.98 79.57,45.91 v1(79.57,45.67)
  Bottom Layer w0.2: 72.03,39.75 72.03,40.23 73.24,41.44 74.26,41.44 75.38,42.57 79.05,42.57 79.36,42.87 79.36,45.46 v1(79.57,45.67)
HT517_DIN: length 26.4
  Top Layer w0.2: v1(73.09,43.99) 73.09,41.25 72.03,40.18 72.03,39.76 ; v1(75.28,49.05) 75.35,48.98 U103.16 ; 67.81,48.23 67.78,48.25 v1(67.78,48.69)
  Bottom Layer w0.2: v1(75.28,49.05) 75.23,49.09 68.19,49.09 v1(67.78,48.69) 67.27,48.69 66.61,48.02 66.61,44.61 67.01,44.2 72.89,44.2 v1(73.09,43.99)
HT517_EN: length 18.2
  Top Layer w0.2: 67.81,46.73 v1(67.81,45.78) ; U103.4 76.38,46.79 v1(75.43,46.79) 75.43,45.93 73.59,44.1 73.59,42.16 74.57,41.18 74.57,39.76
  Bottom Layer w0.2: v1(67.81,45.78) 69.47,45.78 70.48,46.79 v1(75.43,46.79)
HT517_GND: length 11.6
  Top Layer w0.2: U102.17 69.06,47.23 67.81,47.23 ; U102.17 v1(69.56,47.73) U102.11 72.52,47.73 R106.2 ; U102.17 69.06,47.73 U102.15 ; U103.17 78.19,47.73 79.44,47.73 ; U103.17 77.69,47.23 U103.3 ; U103.17 v1(77.69,47.73) U103.15
  vias: v1(63.9,49.5) v1(63.9,42.1) v1(68.77,47.73) v1(70.99,42.21) v1(74.41,42.57) v1(74.92,43.08) v1(78.25,47.48)
HT517_LRCK: length 19.7
  Top Layer w0.2: U103.1 75.39,48.23 74.89,48.72 73.44,48.72 ; 73.44,48.72 72.87,48.72 71.83,49.77 69.73,49.77 69.56,49.59 U102.14 ; 73.44,48.72 73.44,45.05 72.59,44.2 72.59,41.77 72.32,41.49 71.15,41.49 70.84,41.19 70.48,41.19 69.49,40.19 69.49,39.76
HT517_VCC: length 33.3
  Top Layer w0.2: 70.06,45.98 70.06,44.37 ; 70.06,44.37 70.64,44.95 v1(70.64,45.37) ; 70.06,44.37 C104.2 ; 78.69,45.98 78.69,44.51 C106.2 ; 78.17,44.31 78.19,44.33 U103.7 ; C104.2 C103.2 64.35,44.31 64.04,44.63 R105.2 ; C104.2 69.56,44.75 U102.7 ; R107.2 72.67,45.38 v1(72.7,45.35)
  Top Layer w0.4: v1(80.5,44.3) 80.48,44.31 C106.2 C105.2
  Bottom Layer w0.2: v1(75.94,44.63) 75.47,44.63 75.47,44.66 75.18,44.95 74.76,44.95 74.47,44.66 74.47,44.63 73.42,44.63 v1(72.7,45.35) 70.65,45.35 v1(70.64,45.37)
  Bottom Layer w0.4: v1(80.5,44.3) v1(80.5,42.91) v1(80.5,41.92) 80.38,41.8 77.57,41.8 77.11,41.34 77.11,39.75
  vias: v1(70.64,45.98) v1(75.94,43.89)
I2S_EN: length 87.3
  Top Layer w0.2: v1(35.72,56.43) v1(28.22,56.43) ; v1(28.22,54.9) 28.22,53.38 28.29,53.31 ; v1(51,84.35) 42.13,84.35 v1(42.08,84.3) ; v1(42.18,52.57) 41.98,52.36 v1(35.72,52.36)
  Bottom Layer w0.2: v1(35.72,52.36) v1(35.72,56.43) ; v1(28.22,56.43) v1(28.22,54.9) ; H002.7 52.99,107.1 52.34,106.45 52.34,93.69 51.68,93.02 51.68,92.47 51,91.79 v1(51,84.35) ; v1(42.08,84.3) 41.98,84.21 41.98,52.77 v1(42.18,52.57)
INT_02: length 142.2
  Top Layer w0.2: v2(20.78,63.29) 24.11,63.29 U002.4 ; v1(20.26,41.2) 48.53,41.2 v1(48.54,41.19) ; v1(48.54,51.6) J007.7
  Bottom Layer w0.2: 37.62,119.84 38.87,118.59 38.87,115.26 35.46,111.85 21.62,111.85 19.28,109.51 19.28,97.72 19.66,97.34 19.66,97.28 19.63,97.26 19.63,64.46 20.78,63.32 v2(20.78,63.29) 20.78,43.12 20.85,43.05 20.85,42.63 20.78,42.56 20.78,41.73 v1(20.26,41.2) ; v1(48.54,41.19) v1(48.54,51.6)
INT_03: length 139
  Top Layer w0.2: J007.9 49.18,49.06 v1(49.05,49.19) ; v1(19.97,42.2) 20.6,41.57 48.21,41.57 48.33,41.7 v1(49.05,41.7) ; v2(19.66,61.71) 24.15,61.71 U002.5
  Bottom Layer w0.2: 35.08,119.84 36.38,118.55 36.38,113.61 35.21,112.45 21.37,112.45 18.65,109.73 18.65,97.27 18.63,97.25 18.63,96.84 18.92,96.54 19.01,96.54 19.03,96.53 19.03,64.21 19.66,63.58 v2(19.66,61.71) 19.66,42.51 v1(19.97,42.2) ; v1(49.05,41.7) v1(49.05,49.19)
LCD_RESET: length 61.3
  Top Layer w0.2: U002.7 24.15,58.71 v1(22.63,58.71) ; v1(39.78,48.81) v1(24.03,48.81)
  Bottom Layer w0.2: v1(24.03,48.81) 24.03,57.32 v1(22.63,58.71) ; v1(39.78,48.81) 39.78,42.58 35.25,38.06 H006.9
METAL_ENABLE: length 51.7
  Top Layer w0.2: 29.79,53.31 29.75,53.27 v1(29.75,51.86) ; v1(43.34,49.32) v1(29.75,49.32) ; 57.56,31.79 58.7,31.79 58.96,32.04 58.96,40.17 58.56,40.56 43.71,40.56 v1(43.59,40.68)
  Bottom Layer w0.2: v1(29.75,49.32) v1(29.75,51.86) ; v1(43.34,49.32) 43.21,49.19 43.21,41.06 v1(43.59,40.68)
MIC_CLK: length 8.9
  Top Layer w0.2: v1(29.22,5.61) 29.17,5.66 26.96,5.66 26.24,4.94 H101.3 ; 29.22,8.05 29.22,8.68 v1(29.32,8.78)
  Bottom Layer w0.2: v1(29.32,8.78) 29.22,8.67 v1(29.22,5.61)
MIC_DAT: length 6.3
  Top Layer w0.2: 28.4,6.38 28.36,6.34 27.22,6.34 26.29,5.41 25.24,5.41 23.7,3.88 H101.1
MIC_EN: length 6
  Top Layer w0.2: v1(27.48,5.16) 28.04,4.6 28.04,4.07 H101.5 ; R103.2 26.79,6.84 v1(27.12,6.84)
  Bottom Layer w0.2: v1(27.12,6.84) 27.48,6.48 v1(27.48,5.16)
MIC_GND: length 2.8
  Top Layer w0.2: C102.1 C101.1 30.72,9.68 v1(31.02,9.38)
  vias: v1(23.03,7.27) v1(23.76,7.45)
MIC_VCC: length 8.9
  Top Layer w0.2: v1(25.24,8.93) 25.24,9.49 Q101.2 23.52,9.75 23.32,9.94
  Bottom Layer w0.2: H101.2 23.7,3.93 25.24,5.47 v1(25.24,8.93)
  vias: v1(24.58,9.04)
P0_CMA_LIGHT: length 77.8
  Top Layer w0.2: v1(16.03,60.24) 16.03,60.23 U002.6
  Bottom Layer w0.2: v1(16.03,60.24) 15.78,60.49 15.78,79.41 12.09,83.1 12.09,84.26 11.16,85.2 11.16,86.29 9.81,87.63 9.81,102.63 9.82,102.65 9.82,106.84 11.73,108.74 11.73,111.28 16.52,116.08 20.42,116.08 21.11,116.77 21.11,118.57 19.84,119.84
P2_3V3: length 56.4
  Top Layer w0.3: R204.2 R203.2 71.67,93.51 C206.2 C201.2 ; C201.2 76.19,93.51 R201.1 78.94,94.52 90.01,94.52 90.53,93.99 92.91,93.99 ; C201.2 74.48,91.81 U201.4 ; 96.19,83.13 96.19,94.25 95.92,94.52 93.43,94.52 92.91,93.99 ; 96.19,83.13 95.75,83.57 91.56,83.57 ; 96.19,83.13 96.19,76.45 95.78,76.04 R225.1 ; 92.91,93.99 C205.2
P2_5V0: length 60
  Top Layer w0.3: 87.01,86.48 87.01,81.89 C203.2 87.8,79.61 U203.6 ; 87.01,86.48 L201.1 ; 87.01,86.48 87.01,91.27 U204.2 88.25,92.51 92.31,92.51 92.57,92.26 92.57,92.18 C204.2
  Top Layer w0.8: 65.46,78.11 65.46,77.17 66.63,75.99 79.47,75.99 80.4,76.92 80.4,91.52 81.24,92.36 U204.2
P2_GND: length 48.2
  Top Layer w0.3: U201.12 83.3,76.43 84.1,75.64 C202.1 ; U201.12 82.46,79.72 U201.13 ; U201.12 83.86,78.33 85.34,78.33 85.38,78.29 v1(86.34,78.29) 86.59,78.54 86.59,80.3 C203.1 ; 67.73,81.15 67.73,78.93 U201.11 ; 67.73,81.15 67.73,88.54 U201.10 ; 67.73,81.15 67.98,81.4 71.71,81.4 72.28,81.98 U201.6 ; P201.11 93.82,81.93 92.68,83.07 P201.3
  vias: v1(72.06,87.47) v1(72.06,86.86) v1(73.69,94.4) v1(74.36,94.4) v1(82.06,86.86) v1(82.04,83.44) v1(82.06,75.76) v1(82.06,75.13) v1(82.67,83.44) v1(82.8,86.86) v1(95.01,90.63) v1(95.01,90.02) v1(95.01,78.95) v1(95.01,78.34)
P2_LCD_ANODE: length 20.9
  Top Layer w0.3: 89.81,78.7 89.81,82.62 88.9,83.53 D201.1 ; 89.81,78.7 89.81,76.4 89.05,75.64 ; 89.81,78.7 89.44,78.33 U203.5 ; 89.05,75.64 89.76,75.64 90.32,76.2 90.32,82.42 90.47,82.57 P201.2 ; 89.05,75.64 C202.2
